# Altium schematic sheet VFD-Clock.SchDoc
size A2
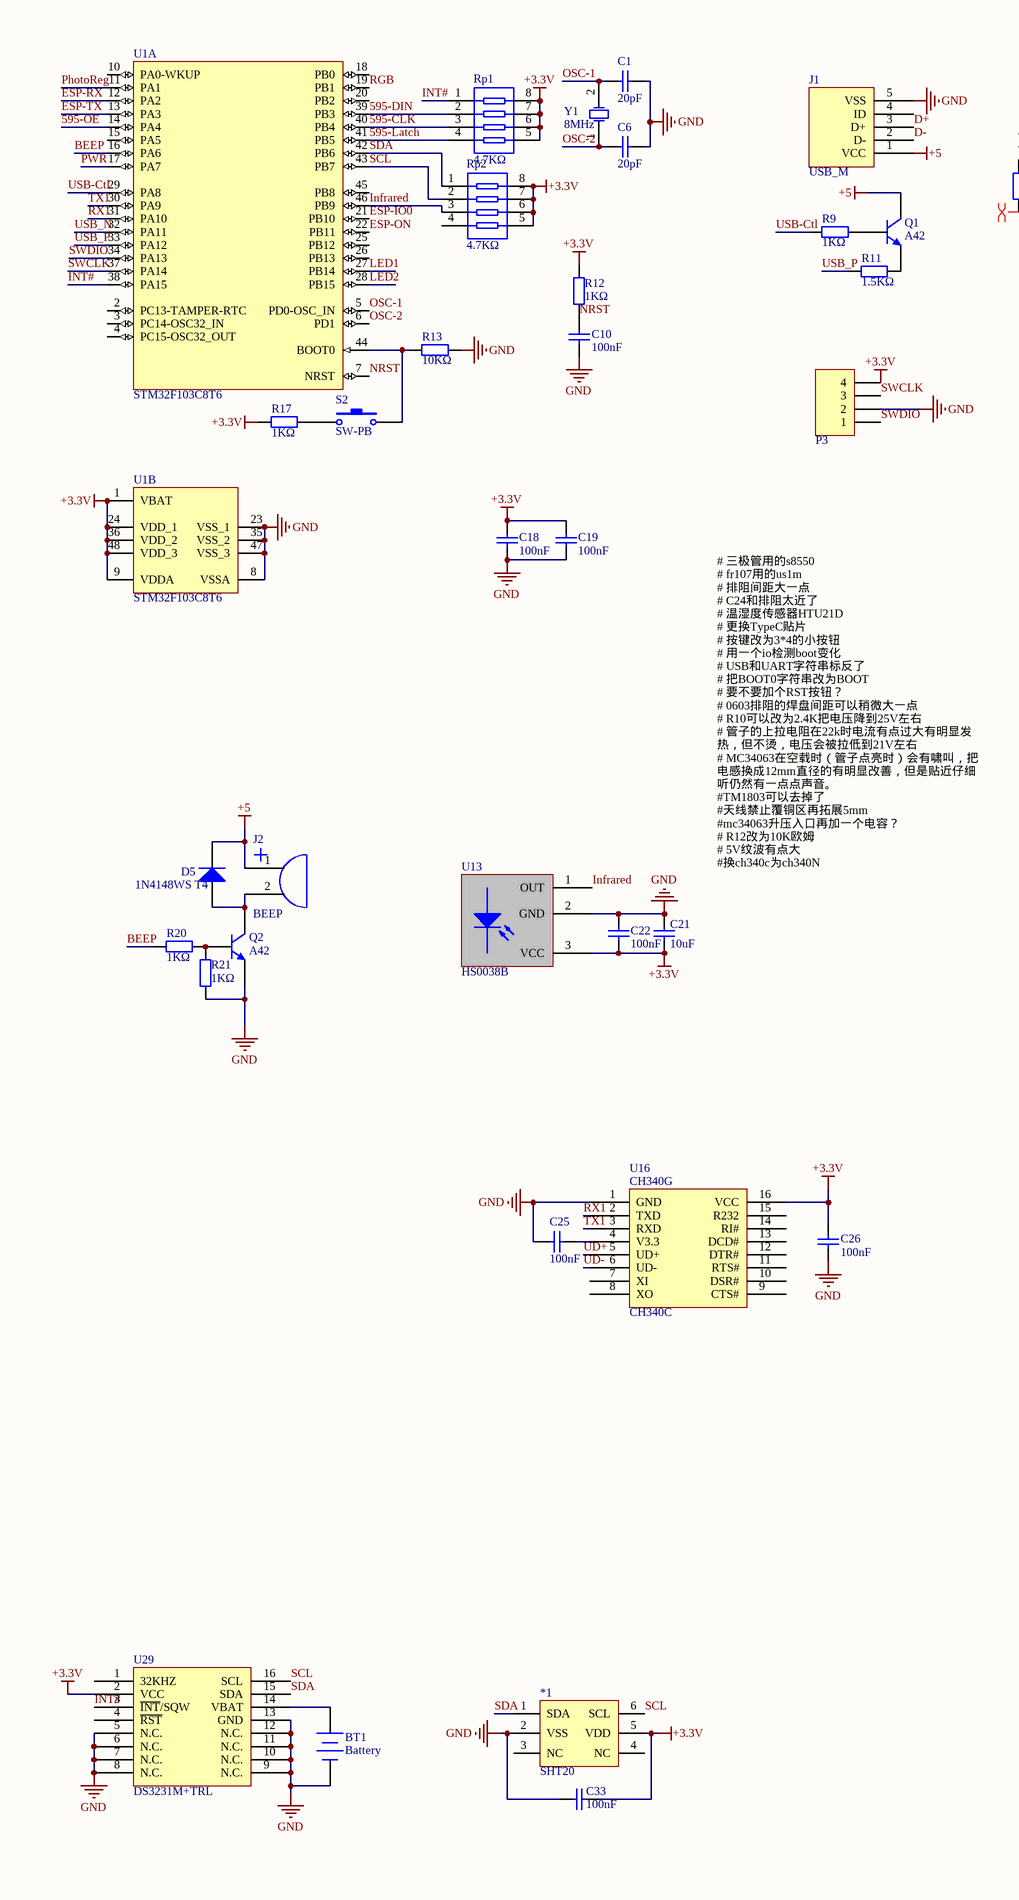
[diagram p0: VFD-Clock.SchDoc, left]
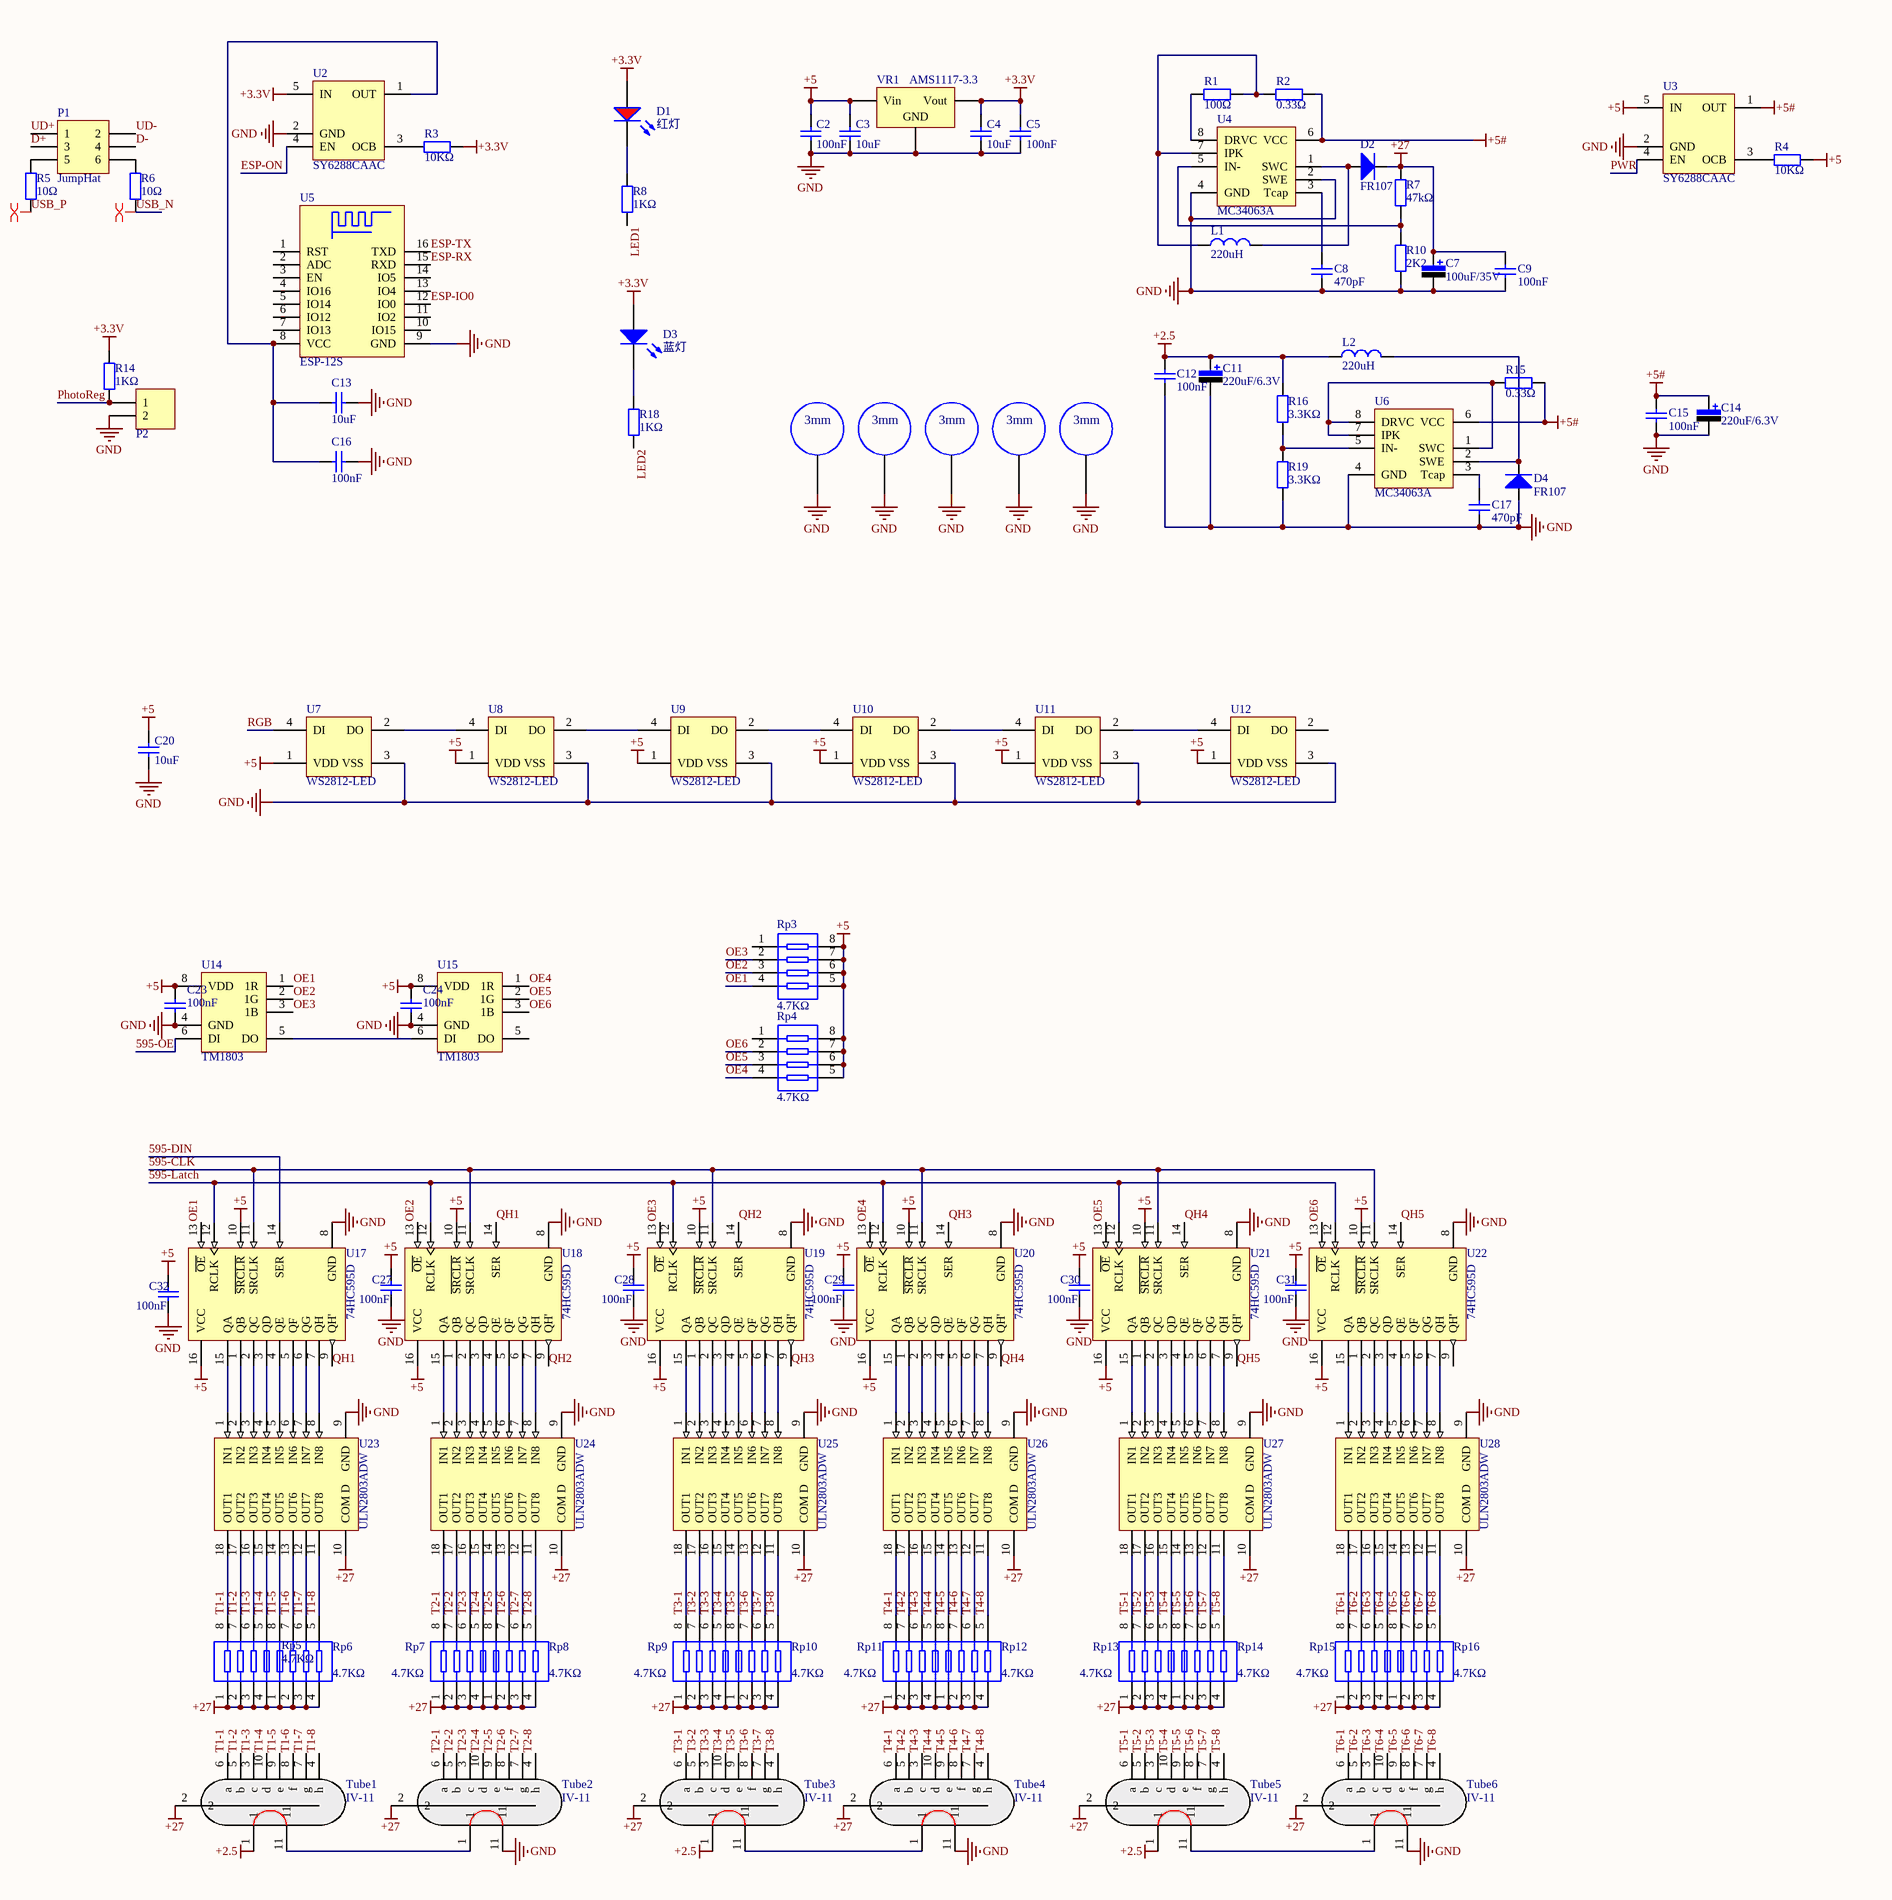
[diagram p1: VFD-Clock.SchDoc, right]

## Parts
*1  SHT20  [DFN6]
BT1  Battery  [CR1220]
C1  20pF  [0805_C]
C2  100nF  [0805_C]
C3  10uF  [0805_C]
C4  10uF  [0805_C]
C5  100nF  [0805_C]
C6  20pF  [0805_C]
C7  100uF/35V  [CAP-7343]
C8  470pF  [0805_C]
C9  100nF  [0805_C]
C10  100nF  [0805_C]
C11  220uF/6.3V  [CAP-3528]
C12  100nF  [0805_C]
C13  10uF  [0805_C]
C14  220uF/6.3V  [CAP-3528]
C15  100nF  [0805_C]
C16  100nF  [0805_C]
C17  470pF  [0805_C]
C18  100nF  [0805_C]
C19  100nF  [0805_C]
C20  10uF  [0805_C]
C21  10uF  [0805_C]
C22  100nF  [0805_C]
C23  100nF  [0805_C]
C24  100nF  [0805_C]
C25  100nF  [0805_C]
C26  100nF  [0805_C]
C27  100nF  [0805_C]
C28  100nF  [0805_C]
C29  100nF  [0805_C]
C30  100nF  [0805_C]
C31  100nF  [0805_C]
C32  100nF  [0805_C]
C33  100nF  [0805_C]
D1  红灯  [0805_LED_S1]
D2  FR107  [DIODE-SMA]
D3  蓝灯  [0805_LED_S1]
D4  FR107  [DIODE-SMA]
D5  1N4148WS T4  [SOD-323]
J1  USB_M  [USB_Micro2]
J2  BEEP  [BEEP-SMD-8530-3V-2.7KHZ]
L1  220uH  [CDRH104R]
L2  220uH  [CDRH104R]
P1  JumpHat  [HDR2X3]
P2  Light Resister  [HDR2X1_A]  (value not drawn)
P3  Header 4  [HDR4X1_A]  (value not drawn)
Q1  A42  [SOT-23(SOT-23-3)]
Q2  A42  [SOT-23(SOT-23-3)]
R1  100Ω  [0805_R]
R2  0.33Ω  [0805_R]
R3  10KΩ  [0805_R]
R4  10KΩ  [0805_R]
R5  10Ω  [0805_R]
R6  10Ω  [0805_R]
R7  47kΩ  [0805_R]
R8  1KΩ  [0805_R]
R9  1KΩ  [0805_R]
R10  2K2  [0805_R]
R11  1.5KΩ  [0805_R]
R12  1KΩ  [0805_R]
R13  10KΩ  [0805_R]
R14  1KΩ  [0805_R]
R15  0.33Ω  [0805_R]
R16  3.3KΩ  [0805_R]
R17  1KΩ  [0805_R]
R18  1KΩ  [0805_R]
R19  3.3KΩ  [0805_R]
R20  1KΩ  [0805_R]
R21  1KΩ  [0805_R]
Rp1  4.7KΩ  [0603_Rx4]
Rp2  4.7KΩ  [0603_Rx4]
Rp3  4.7KΩ  [0603_Rx4]
Rp4  4.7KΩ  [0603_Rx4]
Rp5  4.7KΩ  [0603_Rx4]
Rp6  4.7KΩ  [0603_Rx4]
Rp7  4.7KΩ  [0603_Rx4]
Rp8  4.7KΩ  [0603_Rx4]
Rp9  4.7KΩ  [0603_Rx4]
Rp10  4.7KΩ  [0603_Rx4]
Rp11  4.7KΩ  [0603_Rx4]
Rp12  4.7KΩ  [0603_Rx4]
Rp13  4.7KΩ  [0603_Rx4]
Rp14  4.7KΩ  [0603_Rx4]
Rp15  4.7KΩ  [0603_Rx4]
Rp16  4.7KΩ  [0603_Rx4]
S2  SW-PB  [SW_PB2_A1]
T1  M3铜柱螺丝孔  [螺丝孔-3mm]  (value not drawn)
T2  M3铜柱螺丝孔  [螺丝孔-3mm]  (value not drawn)
T3  M3铜柱螺丝孔  [螺丝孔-3mm]  (value not drawn)
T4  M3铜柱螺丝孔  [螺丝孔-3mm]  (value not drawn)
T5  M3铜柱螺丝孔  [螺丝孔-3mm]  (value not drawn)
Tube1  IV-11  [IV-11-1]
Tube2  IV-11  [IV-11-1]
Tube3  IV-11  [IV-11-1]
Tube4  IV-11  [IV-11-1]
Tube5  IV-11  [IV-11-1]
Tube6  IV-11  [IV-11-1]
U1  STM32F103C8T6  [LQFP-48_7x7x05P]  (parts A,B of 2)
U2  SY6288CAAC  [SOT-23-5]
U3  SY6288CAAC  [SOT-23-5]
U4  MC34063A  [SOP-8]
U5  ESP-12S  [ESP-12S/SMD-16]
U6  MC34063A  [SOP-8]
U7  WS2812-LED  [WS2812]
U8  WS2812-LED  [WS2812]
U9  WS2812-LED  [WS2812]
U10  WS2812-LED  [WS2812]
U11  WS2812-LED  [WS2812]
U12  WS2812-LED  [WS2812]
U13  HS0038B  [HS0038B]
U14  TM1803  [SOP-8]
U15  TM1803  [SOP-8]
U16  CH340C  [SOIC-16_150mil]
U17  74HC595D  [SOIC-16_150mil]
U18  74HC595D  [SOIC-16_150mil]
U19  74HC595D  [SOIC-16_150mil]
U20  74HC595D  [SOIC-16_150mil]
U21  74HC595D  [SOIC-16_150mil]
U22  74HC595D  [SOIC-16_150mil]
U23  ULN2803ADW  [SOIC-18_300mil]
U24  ULN2803ADW  [SOIC-18_300mil]
U25  ULN2803ADW  [SOIC-18_300mil]
U26  ULN2803ADW  [SOIC-18_300mil]
U27  ULN2803ADW  [SOIC-18_300mil]
U28  ULN2803ADW  [SOIC-18_300mil]
U29  DS3231M+TRL  [SOIC-16_300mil]
VR1  AMS1117-3.3  [SOT-223]
Y1  8MHz  [SMD-5032_2P]

## Nets
+2.5: C11.1 C12.1 L2.1 R16.2 Tube1.1 Tube3.1 Tube5.1
+3.3V: *1.5(VDD) C4.2 C5.2 C18.2 C19.2 C21.1 C22.1 C26.2 C33.2 D1.A D3.A P3.4 R3.2 R12.2 R14.2 R17.2 Rp1.5 Rp1.6 Rp1.7 Rp1.8 Rp2.5 Rp2.6 Rp2.7 Rp2.8 U1.1(VBAT) U1.9(VDDA) U1.24(VDD_1) U1.36(VDD_2) U1.48(VDD_3) U2.5(IN) U13.3(VCC) U16.16(VCC) U29.2(VCC) VR1.2(Vout)
+5: C2.2 C3.2 C20.2 C23.2 C24.2 C27.1 C28.1 C29.1 C30.1 C31.1 C32.1 D5.2(K) J1.1(VCC) J2.1 Q1.3(C) R4.2 Rp3.5 Rp3.6 Rp3.7 Rp3.8 Rp4.5 Rp4.6 Rp4.7 Rp4.8 U3.5(IN) U7.1(VDD) U8.1(VDD) U9.1(VDD) U10.1(VDD) U11.1(VDD) U12.1(VDD) U14.8(VDD) U15.8(VDD) U17.10(~{SRCLR}) U17.16(VCC) U18.10(~{SRCLR}) U18.16(VCC) U19.10(~{SRCLR}) U19.16(VCC) U20.10(~{SRCLR}) U20.16(VCC) U21.10(~{SRCLR}) U21.16(VCC) U22.10(~{SRCLR}) U22.16(VCC) VR1.3(Vin)
+5#: C14.1 C15.1 R2.2 R15.2 U3.1(OUT) U4.6(VCC) U6.6(VCC)
+27: C7.1 C9.1 D2.2(K) R7.2 Rp5.1 Rp5.2 Rp5.3 Rp5.4 Rp6.1 Rp6.2 Rp6.3 Rp6.4 Rp7.1 Rp7.2 Rp7.3 Rp7.4 Rp8.1 Rp8.2 Rp8.3 Rp8.4 Rp9.1 Rp9.2 Rp9.3 Rp9.4 Rp10.1 Rp10.2 Rp10.3 Rp10.4 Rp11.1 Rp11.2 Rp11.3 Rp11.4 Rp12.1 Rp12.2 Rp12.3 Rp12.4 Rp13.1 Rp13.2 Rp13.3 Rp13.4 Rp14.1 Rp14.2 Rp14.3 Rp14.4 Rp15.1 Rp15.2 Rp15.3 Rp15.4 Rp16.1 Rp16.2 Rp16.3 Rp16.4 Tube1.2 Tube2.2 Tube3.2 Tube4.2 Tube5.2 Tube6.2 U23.10(COM_D) U24.10(COM_D) U25.10(COM_D) U26.10(COM_D) U27.10(COM_D) U28.10(COM_D)
GND: *1.2(VSS) BT1.2(-) C1.2 C2.1 C3.1 C4.1 C5.1 C6.2 C7.2 C8.1 C9.2 C10.1 C11.2 C12.2 C13.2 C14.2 C15.2 C16.2 C17.1 C18.1 C19.1 C20.1 C21.2 C22.2 C23.1 C24.1 C25.1 C26.1 C27.2 C28.2 C29.2 C30.2 C31.2 C32.2 C33.1 D4.1(A) J1.5(VSS) P2.2 P3.2 Q2.2(E) R10.1 R13.1 R19.1 R21.1 T1.1 T2.1 T3.1 T4.1 T5.1 Tube2.11 Tube4.11 Tube6.11 U1.8(VSSA) U1.23(VSS_1) U1.35(VSS_2) U1.47(VSS_3) U2.2(GND) U3.2(GND) U4.2(SWE) U4.4(GND) U5.9(GND) U6.4(GND) U7.3(VSS) U8.3(VSS) U9.3(VSS) U10.3(VSS) U11.3(VSS) U12.3(VSS) U13.2(GND) U14.4(GND) U15.4(GND) U16.1(GND) U17.8(GND) U18.8(GND) U19.8(GND) U20.8(GND) U21.8(GND) U22.8(GND) U23.9(GND) U24.9(GND) U25.9(GND) U26.9(GND) U27.9(GND) U28.9(GND) U29.5(N.C.) U29.6(N.C.) U29.7(N.C.) U29.8(N.C.) U29.9(N.C.) U29.10(N.C.) U29.11(N.C.) U29.12(N.C.) U29.13(GND) VR1.1(GND)
595-CLK: Rp1.3 U1.40(PB4) U17.11(SRCLK) U18.11(SRCLK) U19.11(SRCLK) U20.11(SRCLK) U21.11(SRCLK) U22.11(SRCLK)
595-DIN: Rp1.2 U1.39(PB3) U17.14(SER)
595-Latch: Rp1.4 U1.41(PB5) U17.12(RCLK) U18.12(RCLK) U19.12(RCLK) U20.12(RCLK) U21.12(RCLK) U22.12(RCLK)
595-OE: U1.14(PA4) U14.6(DI)
BEEP: R20.1 U1.16(PA6)
D+: J1.3(D+) P1.3
D-: J1.2(D-) P1.4
ESP-IO0: U1.21(PB10) U5.12(IO0)
ESP-ON: U1.22(PB11) U2.4(EN)
ESP-RX: U1.12(PA2) U5.15(RXD)
ESP-TX: U1.13(PA3) U5.16(TXD)
Infrared: Rp2.3 U1.46(PB9) U13.1(OUT)
INT#: Rp1.1 U1.38(PA15) U29.3(~{INT}/SQW)
LED1: R8.2 U1.27(PB14)
LED2: R18.2 U1.28(PB15)
NRST: C10.2 R12.1 U1.7(NRST)
OE1: Rp3.4 U14.1(1R) U17.13(~{OE})
OE2: Rp3.3 U14.2(1G) U18.13(~{OE})
OE3: Rp3.2 U14.3(1B) U19.13(~{OE})
OE4: Rp4.4 U15.1(1R) U20.13(~{OE})
OE5: Rp4.3 U15.2(1G) U21.13(~{OE})
OE6: Rp4.2 U15.3(1B) U22.13(~{OE})
OSC-1: C1.1 U1.5(PD0-OSC_IN) Y1.2(OSC2)
OSC-2: C6.1 U1.6(PD1) Y1.1(OSC1)
PhotoReg: P2.1 R14.1 U1.11(PA1)
PWR: U1.17(PA7) U3.4(EN)
QH1: U17.9(QH') U18.14(SER)
QH2: U18.9(QH') U19.14(SER)
QH3: U19.9(QH') U20.14(SER)
QH4: U20.9(QH') U21.14(SER)
QH5: U21.9(QH') U22.14(SER)
RGB: U1.19(PB1) U7.4(DI)
RX1: U1.31(PA10) U16.2(TXD)
SCL: *1.6(SCL) Rp2.2 U1.43(PB7) U29.16(SCL)
SDA: *1.1(SDA) Rp2.1 U1.42(PB6) U29.15(SDA)
SWCLK: P3.3 U1.37(PA14)
SWDIO: P3.1 U1.34(PA13)
T1-1: Rp5.8 Tube1.6(a) U23.18(OUT1)
T1-2: Rp5.7 Tube1.5(b) U23.17(OUT2)
T1-3: Rp5.6 Tube1.3(c) U23.16(OUT3)
T1-4: Rp5.5 Tube1.10(d) U23.15(OUT4)
T1-5: Rp6.8 Tube1.9(e) U23.14(OUT5)
T1-6: Rp6.7 Tube1.8(f) U23.13(OUT6)
T1-7: Rp6.6 Tube1.7(g) U23.12(OUT7)
T1-8: Rp6.5 Tube1.4(h) U23.11(OUT8)
T2-1: Rp7.8 Tube2.6(a) U24.18(OUT1)
T2-2: Rp7.7 Tube2.5(b) U24.17(OUT2)
T2-3: Rp7.6 Tube2.3(c) U24.16(OUT3)
T2-4: Rp7.5 Tube2.10(d) U24.15(OUT4)
T2-5: Rp8.8 Tube2.9(e) U24.14(OUT5)
T2-6: Rp8.7 Tube2.8(f) U24.13(OUT6)
T2-7: Rp8.6 Tube2.7(g) U24.12(OUT7)
T2-8: Rp8.5 Tube2.4(h) U24.11(OUT8)
T3-1: Rp9.8 Tube3.6(a) U25.18(OUT1)
T3-2: Rp9.7 Tube3.5(b) U25.17(OUT2)
T3-3: Rp9.6 Tube3.3(c) U25.16(OUT3)
T3-4: Rp9.5 Tube3.10(d) U25.15(OUT4)
T3-5: Rp10.8 Tube3.9(e) U25.14(OUT5)
T3-6: Rp10.7 Tube3.8(f) U25.13(OUT6)
T3-7: Rp10.6 Tube3.7(g) U25.12(OUT7)
T3-8: Rp10.5 Tube3.4(h) U25.11(OUT8)
T4-1: Rp11.8 Tube4.6(a) U26.18(OUT1)
T4-2: Rp11.7 Tube4.5(b) U26.17(OUT2)
T4-3: Rp11.6 Tube4.3(c) U26.16(OUT3)
T4-4: Rp11.5 Tube4.10(d) U26.15(OUT4)
T4-5: Rp12.8 Tube4.9(e) U26.14(OUT5)
T4-6: Rp12.7 Tube4.8(f) U26.13(OUT6)
T4-7: Rp12.6 Tube4.7(g) U26.12(OUT7)
T4-8: Rp12.5 Tube4.4(h) U26.11(OUT8)
T5-1: Rp13.8 Tube5.6(a) U27.18(OUT1)
T5-2: Rp13.7 Tube5.5(b) U27.17(OUT2)
T5-3: Rp13.6 Tube5.3(c) U27.16(OUT3)
T5-4: Rp13.5 Tube5.10(d) U27.15(OUT4)
T5-5: Rp14.8 Tube5.9(e) U27.14(OUT5)
T5-6: Rp14.7 Tube5.8(f) U27.13(OUT6)
T5-7: Rp14.6 Tube5.7(g) U27.12(OUT7)
T5-8: Rp14.5 Tube5.4(h) U27.11(OUT8)
T6-1: Rp15.8 Tube6.6(a) U28.18(OUT1)
T6-2: Rp15.7 Tube6.5(b) U28.17(OUT2)
T6-3: Rp15.6 Tube6.3(c) U28.16(OUT3)
T6-4: Rp15.5 Tube6.10(d) U28.15(OUT4)
T6-5: Rp16.8 Tube6.9(e) U28.14(OUT5)
T6-6: Rp16.7 Tube6.8(f) U28.13(OUT6)
T6-7: Rp16.6 Tube6.7(g) U28.12(OUT7)
T6-8: Rp16.5 Tube6.4(h) U28.11(OUT8)
TX1: U1.30(PA9) U16.3(RXD)
UD+: P1.1 U16.5(UD+)
UD-: P1.2 U16.6(UD-)
USB-Ctl: R9.1 U1.29(PA8)
USB_N: R6.1 U1.32(PA11)
USB_P: R5.2 R11.2 U1.33(PA12)
NetBT1_1: BT1.1(+) U29.14(VBAT)
NetC8_2: C8.2 U4.3(Tcap)
NetC13_1: C13.1 C16.1 U2.1(OUT) U5.8(VCC)
NetC17_2: C17.2 U6.3(Tcap)
NetC25_2: C25.2 U16.4(V3.3)
NetD1_K: D1.K R8.1
NetD2_1: D2.1(A) L1.2 U4.1(SWC)
NetD3_K: D3.K R18.1
NetD4_2: D4.2(K) L2.2 U6.2(SWE)
NetD5_1: D5.1(A) J2.2 Q2.3(C)
NetL1_1: L1.1 R1.2 R2.1 U4.7(IPK)
NetP1_5: P1.5 R5.1
NetP1_6: P1.6 R6.2
NetQ1_1: Q1.1(B) R9.2
NetQ1_2: Q1.2(E) R11.1
NetQ2_1: Q2.1(B) R20.2 R21.2
NetR1_1: R1.1 U4.8(DRVC)
NetR3_1: R3.1 U2.3(OCB)
NetR4_1: R4.1 U3.3(OCB)
NetR7_1: R7.1 R10.2 U4.5(IN-)
NetR13_2: R13.2 S2.2 U1.44(BOOT0)
NetR15_1: R15.1 U6.1(SWC) U6.7(IPK) U6.8(DRVC)
NetR16_1: R16.1 R19.2 U6.5(IN-)
NetR17_1: R17.1 S2.1
NetTube1_11: Tube1.11 Tube2.1
NetTube3_11: Tube3.11 Tube4.1
NetTube5_11: Tube5.11 Tube6.1
NetU7_2: U7.2(DO) U8.4(DI)
NetU8_2: U8.2(DO) U9.4(DI)
NetU9_2: U9.2(DO) U10.4(DI)
NetU10_2: U10.2(DO) U11.4(DI)
NetU11_2: U11.2(DO) U12.4(DI)
NetU14_5: U14.5(DO) U15.6(DI)
NetU17_1: U17.1(QB) U23.2(IN2)
NetU17_2: U17.2(QC) U23.3(IN3)
NetU17_3: U17.3(QD) U23.4(IN4)
NetU17_4: U17.4(QE) U23.5(IN5)
NetU17_5: U17.5(QF) U23.6(IN6)
NetU17_6: U17.6(QG) U23.7(IN7)
NetU17_7: U17.7(QH) U23.8(IN8)
NetU17_15: U17.15(QA) U23.1(IN1)
NetU18_1: U18.1(QB) U24.2(IN2)
NetU18_2: U18.2(QC) U24.3(IN3)
NetU18_3: U18.3(QD) U24.4(IN4)
NetU18_4: U18.4(QE) U24.5(IN5)
NetU18_5: U18.5(QF) U24.6(IN6)
NetU18_6: U18.6(QG) U24.7(IN7)
NetU18_7: U18.7(QH) U24.8(IN8)
NetU18_15: U18.15(QA) U24.1(IN1)
NetU19_1: U19.1(QB) U25.2(IN2)
NetU19_2: U19.2(QC) U25.3(IN3)
NetU19_3: U19.3(QD) U25.4(IN4)
NetU19_4: U19.4(QE) U25.5(IN5)
NetU19_5: U19.5(QF) U25.6(IN6)
NetU19_6: U19.6(QG) U25.7(IN7)
NetU19_7: U19.7(QH) U25.8(IN8)
NetU19_15: U19.15(QA) U25.1(IN1)
NetU20_1: U20.1(QB) U26.2(IN2)
NetU20_2: U20.2(QC) U26.3(IN3)
NetU20_3: U20.3(QD) U26.4(IN4)
NetU20_4: U20.4(QE) U26.5(IN5)
NetU20_5: U20.5(QF) U26.6(IN6)
NetU20_6: U20.6(QG) U26.7(IN7)
NetU20_7: U20.7(QH) U26.8(IN8)
NetU20_15: U20.15(QA) U26.1(IN1)
NetU21_1: U21.1(QB) U27.2(IN2)
NetU21_2: U21.2(QC) U27.3(IN3)
NetU21_3: U21.3(QD) U27.4(IN4)
NetU21_4: U21.4(QE) U27.5(IN5)
NetU21_5: U21.5(QF) U27.6(IN6)
NetU21_6: U21.6(QG) U27.7(IN7)
NetU21_7: U21.7(QH) U27.8(IN8)
NetU21_15: U21.15(QA) U27.1(IN1)
NetU22_1: U22.1(QB) U28.2(IN2)
NetU22_2: U22.2(QC) U28.3(IN3)
NetU22_3: U22.3(QD) U28.4(IN4)
NetU22_4: U22.4(QE) U28.5(IN5)
NetU22_5: U22.5(QF) U28.6(IN6)
NetU22_6: U22.6(QG) U28.7(IN7)
NetU22_7: U22.7(QH) U28.8(IN8)
NetU22_15: U22.15(QA) U28.1(IN1)

Not connected (* = marked no-connect by the designer): *1 3(NC) 4(NC); J1 4(ID); Rp2 4; Rp3 1; Rp4 1; U1 2(PC13-TAMPER-RTC) 3(PC14-OSC32_IN) 4(PC15-OSC32_OUT) 10(PA0-WKUP) 15(PA5) 18(PB0) 20(PB2) 25(PB12) 26(PB13) 45(PB8); U5 1(RST) 2(ADC) 3(EN) 4(IO16) 5(IO14) 6(IO12) 7(IO13) 10(IO15) 11(IO2) 13(IO4) 14(IO5); U12 2(DO); U15 5(DO); U16 7(XI) 8(XO) 9(CTS#) 10(DSR#) 11(RTS#) 12(DTR#) 13(DCD#) 14(RI#) 15(R232); U22 9(QH'); U29 1(32KHZ) 4(~{RST})

## Layout directives
differential pair: USB_N, USB_P

## Notes on the sheet
- # 三极管用的s8550
  # fr107用的us1m
  # 排阻间距大一点
  # C24和排阻太近了
  # 温湿度传感器HTU21D
  # 更换TypeC贴片
  # 按键改为3*4的小按钮
  # 用一个io检测boot变化
  # USB和UART字符串标反了
  # 把BOOT0字符串改为BOOT
  # 要不要加个RST按钮？
  # 0603排阻的焊盘间距可以稍微大一点
  # R10可以改为2.4K把电压降到25V左右
  # 管子的上拉电阻在22k时电流有点过大有明显发热，但不烫，电压会被拉低到21V左右
  # MC34063在空载时（管子点亮时）会有啸叫，把电感换成12mm直径的有明显改善，但是贴近仔细听仍然有一点点声音。
  #TM1803可以去掉了
  #天线禁止覆铜区再拓展5mm
  #mc34063升压入口再加一个电容？
  # R12改为10K欧姆
  # 5V纹波有点大
  #换ch340c为ch340N
- Title
- Size:
- Date:
- File:
- A2
- Number:
- Time:
- Revision:
- Sheet
- of
- (in symbol CH340G_[C14267]) CH340G
- (in symbol M3铜柱螺丝孔) 3mm

## Library data of the parts
*1 = SHT20: 温湿度传感器
BT1 = Battery: 备份电池; Published: 24-Mar-1999; LatestRevisionDate: 17-Jul-2002; LatestRevisionNote: Re-released for DXP Platform.; PackageReference: BAT-2; Publisher: Altium Limited
C1 C6 = 0805 20pF (200) 5% 50V: 贴片电容; ComponentLink1Description: 供应商链接; ComponentLink1URL: http://www.szlcsc.com/product/details_2150.html; Package: 0805; Supplier: LC; SuppliersPartNumber: C1798
C2 C5 C9 C10 C12 C15 C16 C18 C19 C22-C33 = 0805 100nF(104) 10% 50V: 贴片电容; ComponentLink1Description: 供应商链接; ComponentLink1URL: http://www.szlcsc.com/product/details_50686.html; Package: 0805; Supplier: LC; SuppliersPartNumber: C49678
C3 C4 C13 C20 C21 = 0805 10uF (106) 10% 25V: 贴片电容; ComponentLink1Description: 供应商链接; ComponentLink1URL: http://www.szlcsc.com/product/details_16532.html; Package: 0805; Supplier: LC; SuppliersPartNumber: C15850
C7 C11 C14 = Cap Pol: 极性电解电容; Published: 8-Jun-2000; LatestRevisionDate: 17-Jul-2002; LatestRevisionNote: Re-released for DXP Platform.; PackageReference: RB7.6-15; Publisher: Altium Limited
C8 C17 = 0805 470pF (471) 10% 50V: 贴片电容; ComponentLink1Description: 供应商链接; ComponentLink1URL: http://www.szlcsc.com/product/details_2095.html; Package: 0805; Supplier: LC; SuppliersPartNumber: C1743
D1 = 0805 红灯: 发光二极管; ComponentLink1Description: 供应商链接; ComponentLink1URL: http://www.szlcsc.com/product/details_2668.html; Package: 0805; Supplier: LC; SuppliersPartNumber: C2295
D2 D4 = Diode: 二极管; Published: 8-Jun-2000; LatestRevisionDate: 17-Jul-2002; LatestRevisionNote: Re-released for DXP Platform.; PackageDocument: Sep-1996; PackageReference: SMC; Publisher: Altium Limited; Code_JEDEC: DO-214-AB
D3 = 0805 蓝灯: 发光二极管; ComponentLink1Description: 供应商链接; ComponentLink1URL: http://www.szlcsc.com/product/details_2666.html; Package: 0805; Supplier: LC; SuppliersPartNumber: C2293
D5 = SOD-323 1N4148WS T4: 二极管; ComponentLink1Description: 供应商链接; ComponentLink1URL: http://www.szlcsc.com/product/details_2485.html; Package: SOD-323; Supplier: LC; SuppliersPartNumber: C2128
J1 = USB_M: MicroUSB接口
J2 = BEEP: 蜂鸣器
L1 L2 = Inductor: 电感; Code_IEC: 1005; Published: 8-Jun-2000; LatestRevisionDate: 17-Jul-2002; LatestRevisionNote: Re-released for DXP Platform.; PackageReference: 0402-A; Publisher: Altium Limited; Code_JEITA: 0402
P1 = Header 3X2: Header, 3-Pin, Dual row; LatestRevisionDate: 17-Jul-2002; LatestRevisionNote: Re-released for DXP Platform.; Publisher: Altium Limited
P2 = : 光敏电阻; LatestRevisionDate: 17-Jul-2002; LatestRevisionNote: Re-released for DXP Platform.; Publisher: Altium Limited
P3 = Header 4: 接插件; LatestRevisionDate: 17-Jul-2002; LatestRevisionNote: Re-released for DXP Platform.; Publisher: Altium Limited
Q1 Q2 = SOT-23 SS8050 Y1: 三极管; ComponentLink1Description: 供应商链接; ComponentLink1URL: http://www.szlcsc.com/product/details_2507.html; Package: SOT-23; Supplier: LC; SuppliersPartNumber: C2150
R1 R2 R7 R10 R15 = 0805 100Ω (1000) 1%: 贴片电阻; ComponentLink1Description: 供应商链接; ComponentLink1URL: http://www.szlcsc.com/product/details_18096.html; Package: 0805; Supplier: LC; SuppliersPartNumber: C17408
R3 R4 R13 = 0805 10KΩ (1002) 1%: 贴片电阻; ComponentLink1Description: 供应商链接; ComponentLink1URL: http://www.szlcsc.com/product/details_18102.html; Package: 0805; Supplier: LC; SuppliersPartNumber: C17414
R5 R6 = 0805 10Ω (10R0) 1%: 贴片电阻; ComponentLink1Description: 供应商链接; ComponentLink1URL: http://www.szlcsc.com/product/details_18103.html; Package: 0805; Supplier: LC; SuppliersPartNumber: C17415
R8 R9 R12 R14 R17 R18 R20 R21 = 0805 1KΩ (1001) 1%: 贴片电阻; ComponentLink1Description: 供应商链接; ComponentLink1URL: http://www.szlcsc.com/product/details_18201.html; Package: 0805; Supplier: LC; SuppliersPartNumber: C17513
R11 = 0805 1.5KΩ (1501) 1%: 贴片电阻; ComponentLink1Description: 供应商链接; ComponentLink1URL: http://www.szlcsc.com/product/details_4717.html; Package: 0805; Supplier: LC; SuppliersPartNumber: C4310
R16 R19 = 0805 3.3KΩ (3301) 1%: 贴片电阻; ComponentLink1Description: 供应商链接; ComponentLink1URL: http://www.szlcsc.com/product/details_26753.html; Package: 0805; Supplier: LC; SuppliersPartNumber: C26010
Rp1-Rp16 = 0603*4  4.7KΩ (472) 5%: 贴片排阻; ComponentLink1Description: 供应商链接; ComponentLink1URL: http://www.szlcsc.com/product/details_2332.html; Package: 0603*4; Supplier: LC; SuppliersPartNumber: C1980
S2 = SW-PB: 微动开关; Published: 24-Mar-1999; LatestRevisionDate: 17-Jul-2002; LatestRevisionNote: Re-released for DXP Platform.; PackageReference: SPST-2; Publisher: Altium Limited
Tube1-Tube6 = IV-11: 荧光数码管
U1 = STM32F103C8T6: ARM; ComponentLink1Description: 供应商链接; ComponentLink1URL: http://www.szlcsc.com/product/details_9243.html; Package: LQFP-48_7x7x05P; Supplier: LC; SuppliersPartNumber: C8734
U2 U3 = SY6288CAAC: 5V2A功率开关芯片
U5 = ESP-12S: ESP8266 串口WIFI 16Pin
U13 = HS0038B: 红外接收器
U14 U15 = TM1803: 3通道RGB全彩驱动芯片
U16 = CH340G_[C14267]: USB; ComponentLink1Description: 供应商链接; ComponentLink1URL: http://www.szlcsc.com/product/details_14927.html; Package: SOIC-16_150mil; Supplier: LC; SuppliersPartNumber: C14267
U17-U22 = 74HC595D_[C5947]: 74系列逻辑芯片; ComponentLink1Description: 供应商链接; ComponentLink1URL: http://www.szlcsc.com/product/details_6413.html; Package: SOIC-16_150mil; Supplier: LC; SuppliersPartNumber: C5947
U23-U28 = ULN2803ADW_[C9683]: 大电流驱动; ComponentLink1Description: 供应商链接; ComponentLink1URL: http://www.szlcsc.com/product/details_10213.html; Package: SOIC-18_300mil; Supplier: LC; SuppliersPartNumber: C9683
U29 = DS3231M+TRL_[C37663]: 实时时钟; ComponentLink1Description: 供应商链接; ComponentLink1URL: http://www.szlcsc.com/product/details_38643.html; Package: SOIC-16_300mil; Supplier: LC; SuppliersPartNumber: C37663
VR1 = SOT-223 AMS1117-3.3: 低压差线性稳压(LDO); ComponentLink1Description: 供应商链接; ComponentLink1URL: http://www.szlcsc.com/product/details_6652.html; Package: SOT-223; Supplier: LC; SuppliersPartNumber: C6186
Y1 = SMD-5032_2P 8MHz 20ppm 20pF: 贴片晶振; ComponentLink1Description: 供应商链接; ComponentLink1URL: http://www.szlcsc.com/product/details_117214.html; Package: SMD-5032_2P; Supplier: LC; SuppliersPartNumber: C115962